# Altium project BLDC_v3.PrjPcb
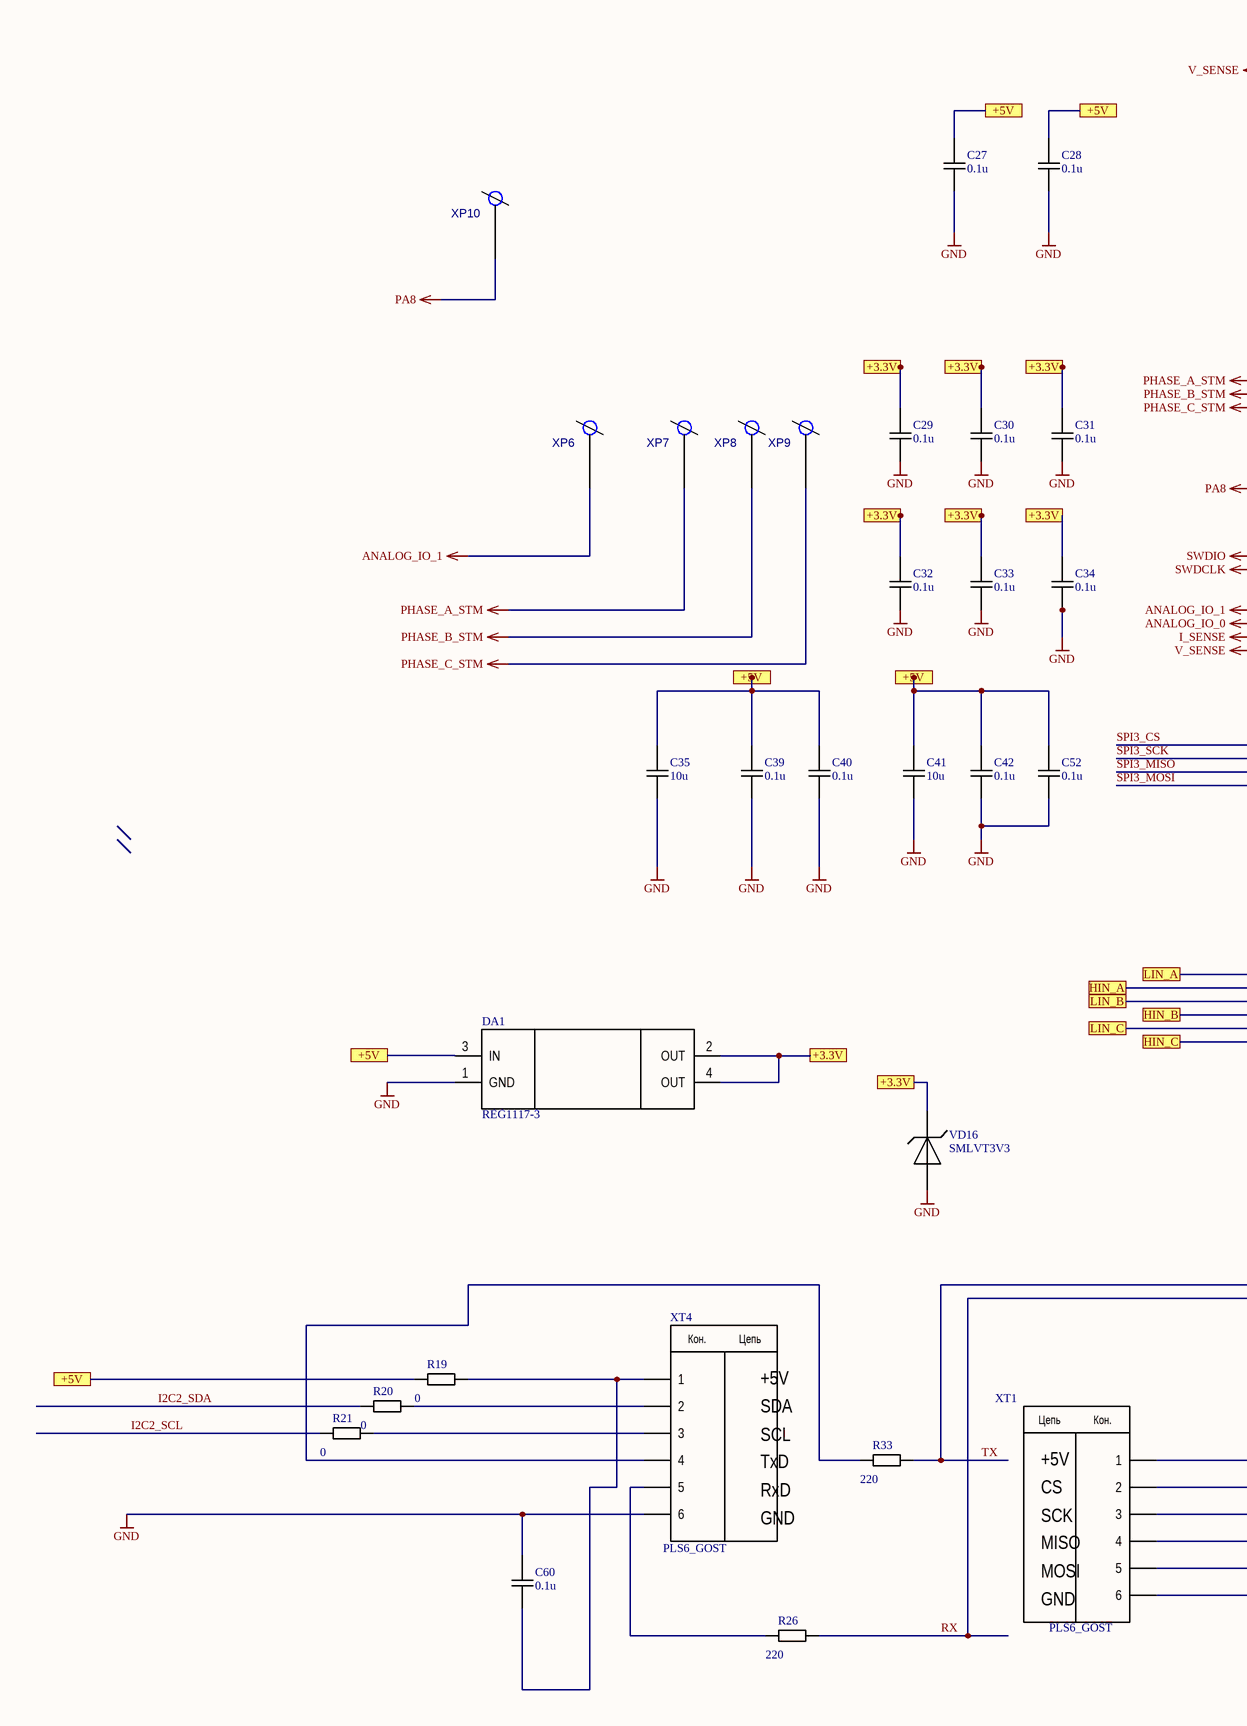
[diagram p0: BLDC_v3.SCHDOC, left]
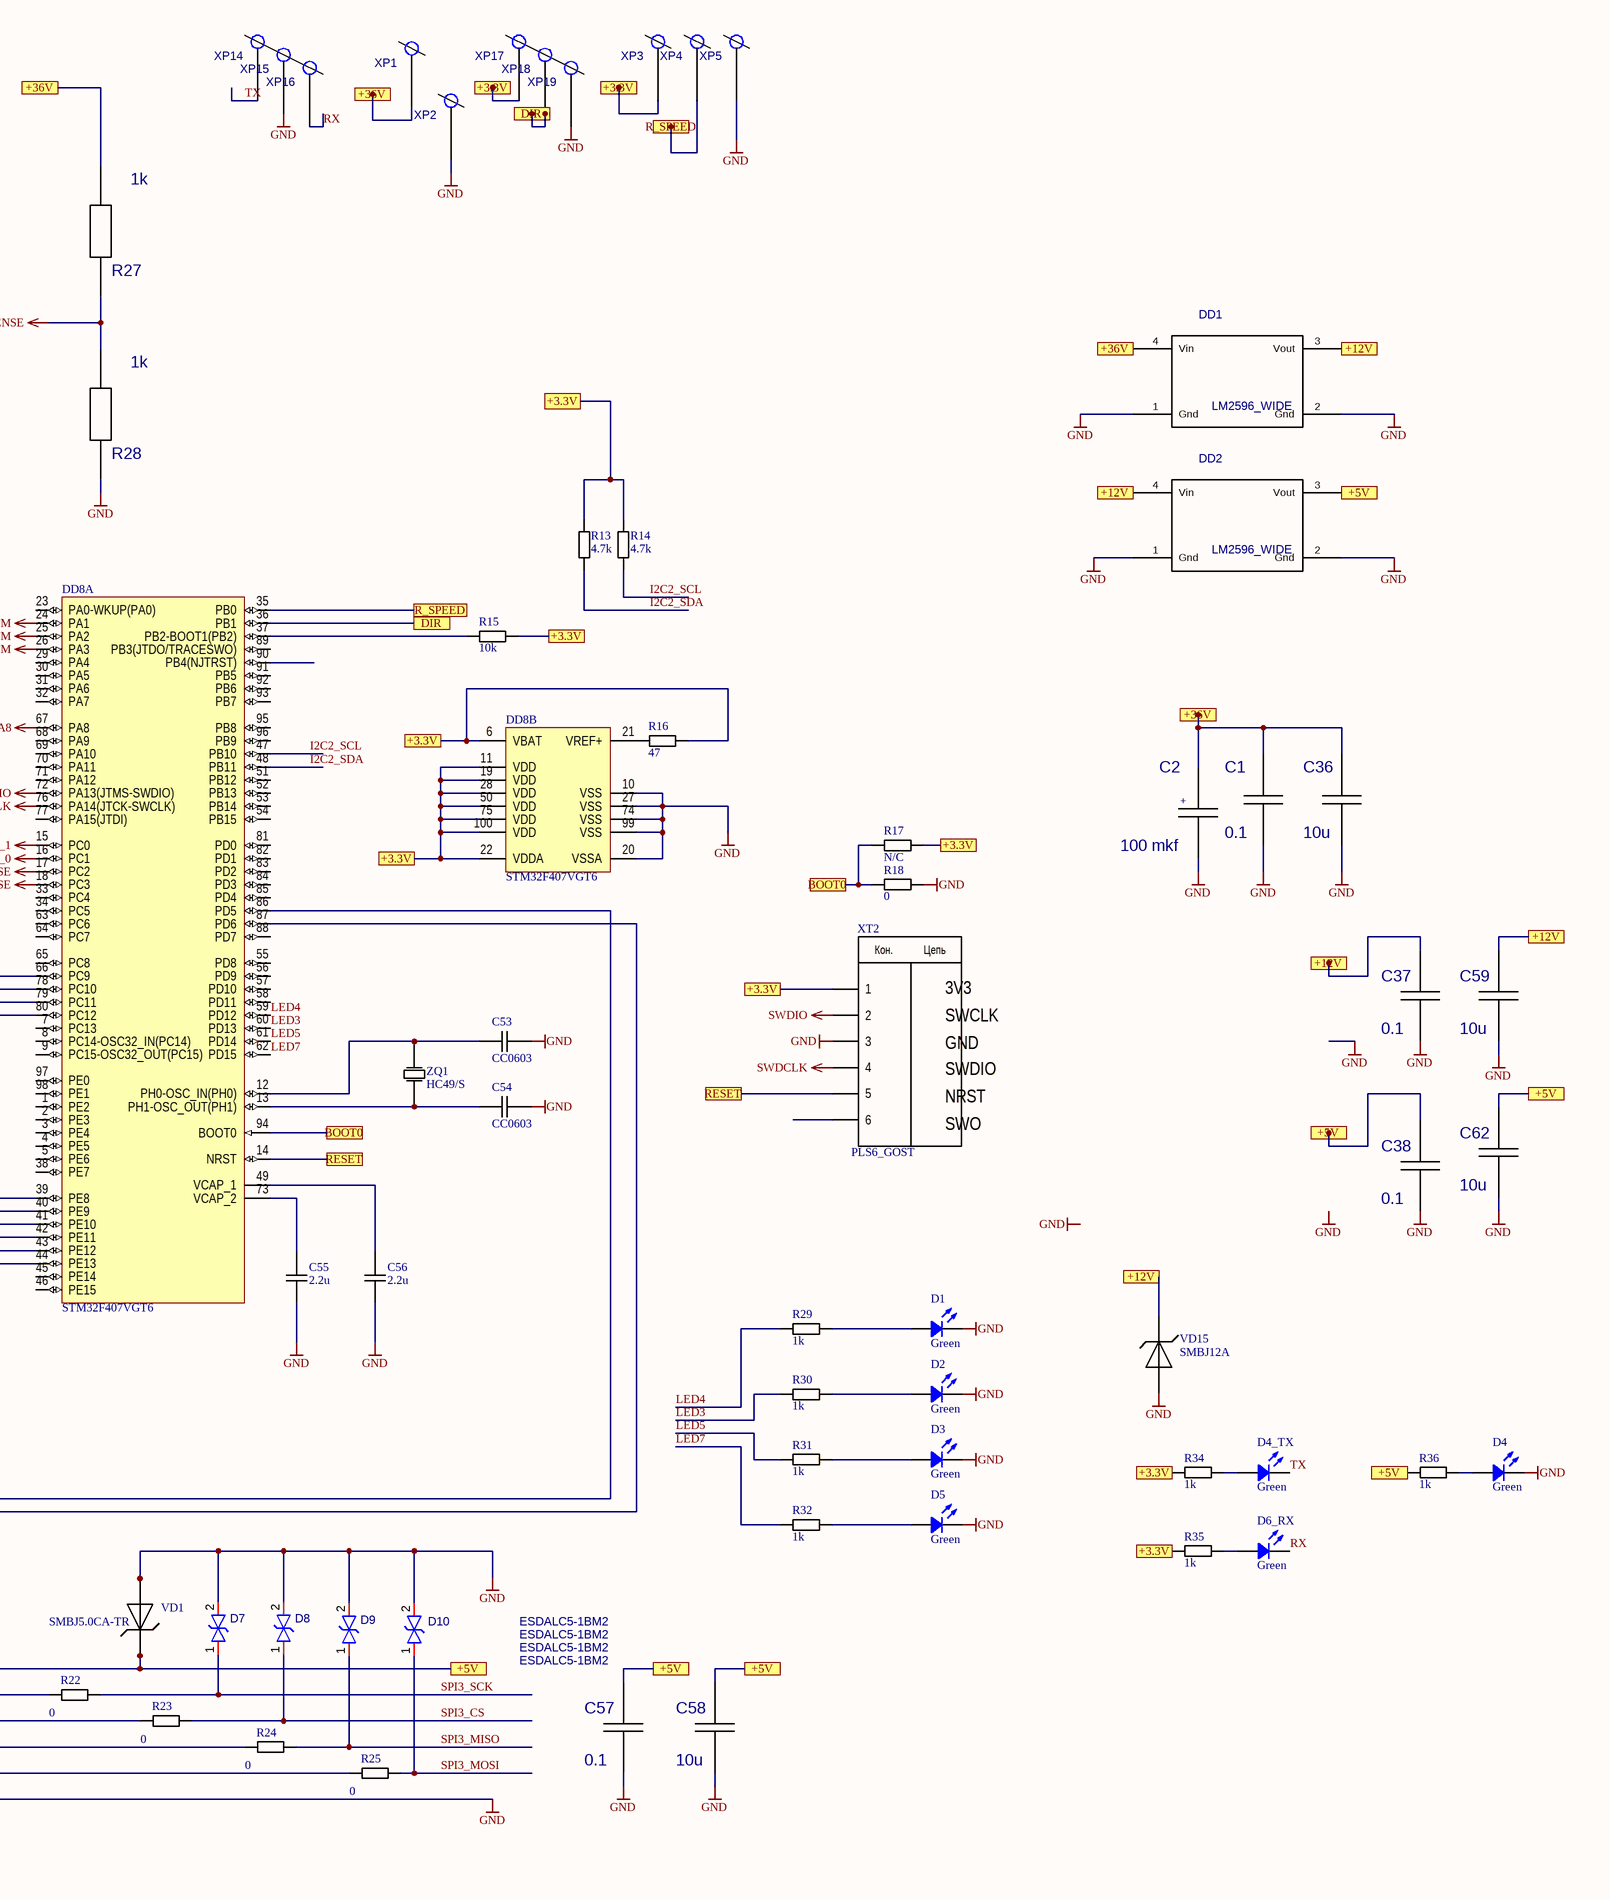
[diagram p1: BLDC_v3.SCHDOC, right]
1 sheet, 90 parts. Net scope: global (net labels, ports and power ports of the same name join across sheets).
Board file: BLDC_v3.PcbDoc

## Sheet BLDC_v3.SCHDOC
size 594 x 420 mm; CompanyName: МГТУ СМ-7; SheetNumber: 1; SheetTotal: 2; Scale: 1:1; Title2str: Драйвер BLDC; DocumentType: Схема электрическая принципиальная

### Parts
C1  value 0.1  [RC1206]  (hidden comment: C_1206)
C2  value 100 mkf  [C100_WIDE]  (hidden comment: C100_V_WIDE)
C27  0.1u  [SMT0603CAP/VISHAY]
C28  0.1u  [SMT0603CAP/VISHAY]
C29  0.1u  [SMT0603CAP/VISHAY]
C30  0.1u  [SMT0603CAP/VISHAY]
C31  0.1u  [SMT0603CAP/VISHAY]
C32  0.1u  [SMT0603CAP/VISHAY]
C33  0.1u  [SMT0603CAP/VISHAY]
C34  0.1u  [SMT0603CAP/VISHAY]
C35  10u  [SMT0603CAP/VISHAY]
C36  value 10u  [RC1206]  (hidden comment: C_1206)
C37  value 0.1  [RC1206]  (hidden comment: C_1206)
C38  value 0.1  [RC1206]  (hidden comment: C_1206)
C39  0.1u  [SMT0603CAP/VISHAY]
C40  0.1u  [SMT0603CAP/VISHAY]
C41  10u  [SMT0603CAP/VISHAY]
C42  0.1u  [SMT0603CAP/VISHAY]
C52  0.1u  [SMT0603CAP/VISHAY]
C53  CC0603  [SMT0603CAP/VISHAY]
C54  CC0603  [SMT0603CAP/VISHAY]
C55  2.2u  [SMT0603CAP/VISHAY]
C56  2.2u  [SMT0603CAP/VISHAY]
C57  value 0.1  [RC1206]  (hidden comment: C_1206)
C58  value 10u  [RC1206]  (hidden comment: C_1206)
C59  value 10u  [RC1206]  (hidden comment: C_1206)
C60  0.1u  [SMT0603CAP/VISHAY]
C62  value 10u  [RC1206]  (hidden comment: C_1206)
D1  Green  [LED 0805/2012 BLUE]
D2  Green  [LED 0805/2012 BLUE]
D3  Green  [LED 0805/2012 BLUE]
D4  Green  [LED 0805/2012 BLUE]
D4_TX  Green  [LED 0805/2012 BLUE]
D5  Green  [LED 0805/2012 BLUE]
D6_RX  Green  [LED 0805/2012 BLUE]
D7  ESDALC5-1BM2  [STM-SOD-882_BD_V]
D8  ESDALC5-1BM2  [STM-SOD-882_BD_V]
D9  ESDALC5-1BM2  [STM-SOD-882_BD_V]
D10  ESDALC5-1BM2  [STM-SOD-882_BD_V]
DA1  REG1117-3  [ZZ311]
DD1  LM2596_WIDE  [LM2596_WIDE]
DD2  LM2596_WIDE  [LM2596_WIDE]
DD8  STM32F407VGT6  [STM-LQFP100_N]  (parts A,B of 2)
R13  4.7k  [SMT0603/VISHAY]
R14  4.7k  [SMT0603/VISHAY]
R15  10k  [SMT0603/VISHAY]
R16  47  [SMT0603/VISHAY]
R17  N/C  [SMT0603/VISHAY]
R18  0  [SMT0603/VISHAY]
R19  0  [SMT0603/VISHAY]
R20  0  [SMT0603/VISHAY]
R21  0  [SMT0603/VISHAY]
R22  0  [SMT0603/VISHAY]
R23  0  [SMT0603/VISHAY]
R24  0  [SMT0603/VISHAY]
R25  0  [SMT0603/VISHAY]
R26  220  [SMT0603/VISHAY]
R27  value 1k  [CC1206]  (hidden comment: R_1206)
R28  value 1k  [CC1206]  (hidden comment: R_1206)
R29  1k  [SMT0603/VISHAY]
R30  1k  [SMT0603/VISHAY]
R31  1k  [SMT0603/VISHAY]
R32  1k  [SMT0603/VISHAY]
R33  220  [SMT0603/VISHAY]
R34  1k  [SMT0603/VISHAY]
R35  1k  [SMT0603/VISHAY]
R36  1k  [SMT0603/VISHAY]
VD1  SMBJ5.0CA-TR  [DO214AA SMB]
VD15  SMBJ12A  [DO214AA SMB]
VD16  SMLVT3V3  [DO214AA SMB]
XP1  XP_1_WIDE  [XP_WIDE]  (value not drawn)
XP2  XP_1_WIDE  [XP_WIDE]  (value not drawn)
XP3  XP_1_WIDE  [XP_WIDE]  (value not drawn)
XP4  XP_1_WIDE  [XP_WIDE]  (value not drawn)
XP5  XP_1_WIDE  [XP_WIDE]  (value not drawn)
XP6  XP_1_WIDE  [XP_WIDE]  (value not drawn)
XP7  XP_1_WIDE  [XP_WIDE]  (value not drawn)
XP8  XP_1_WIDE  [XP_WIDE]  (value not drawn)
XP9  XP_1_WIDE  [XP_WIDE]  (value not drawn)
XP10  XP_1_WIDE  [XP_WIDE]  (value not drawn)
XP14  XP_1_WIDE  [XP_WIDE]  (value not drawn)
XP15  XP_1_WIDE  [XP_WIDE]  (value not drawn)
XP16  XP_1_WIDE  [XP_WIDE]  (value not drawn)
XP17  XP_1_WIDE  [XP_WIDE]  (value not drawn)
XP18  XP_1_WIDE  [XP_WIDE]  (value not drawn)
XP19  XP_1_WIDE  [XP_WIDE]  (value not drawn)
XT1  PLS6_GOST  [XP_6_PIN]
XT2  PLS6_GOST  [XP_6_PIN]
XT4  PLS6_GOST  [XP_6_PIN]
ZQ1  HC49/S  [HS49/S]

### Ports
+3.3V, +5V, +12V, +36V, BOOT0, DIR, HIN_A, HIN_B, HIN_C, LIN_A, LIN_B, LIN_C, R_SPEED, RESET

### Nets
ANALOG_IO_0: DD8.16(PC1)
ANALOG_IO_1: DD8.15(PC0) XP6.1
GND: C1.1(A1) C2.2(A1) C27.1 C28.1 C29.1 C30.1 C31.1 C32.1 C33.1 C34.1 C35.1 C36.1(A1) C37.1(A1) C38.1(A1) C39.1 C40.1 C41.1 C42.1 C52.1 C53.2 C54.2 C55.1 C56.1 C57.1(A1) C58.1(A1) C59.1(A1) C60.2 C62.1(A1) D1.2 D2.2 D3.2 D4.2 D5.2 D7.2(A) D8.2(A) D9.2(A) D10.2(A) DA1.1(GND) DD1.1(Gnd) DD1.2(Gnd) DD2.1(Gnd) DD2.2(Gnd) DD8.10(VSS) DD8.20(VSSA) DD8.27(VSS) DD8.74(VSS) DD8.99(VSS) R18.1 R28.1(A1) VD1.1 VD15.1 VD16.1 XP2.1 XP5.1 XP15.1 XP19.1 XT1.6 XT2.3 XT4.6
I_SENSE: DD8.17(PC2)
PA8: DD8.67(PA8) XP10.1
PHASE_A_STM: DD8.24(PA1) XP7.1
PHASE_B_STM: DD8.25(PA2) XP8.1
PHASE_C_STM: DD8.26(PA3) XP9.1
SWDCLK: DD8.76(PA14(JTCK-SWCLK)) XT2.4
SWDIO: DD8.72(PA13(JTMS-SWDIO)) XT2.2
V_SENSE: DD8.18(PC3) R27.1(A1) R28.2(A2)
+3.3V: C29.2 C30.2 C31.2 C32.2 C33.2 C34.2 DA1.2(OUT) DA1.4(OUT) DD8.6(VBAT) DD8.11(VDD) DD8.19(VDD) DD8.22(VDDA) DD8.28(VDD) DD8.50(VDD) DD8.75(VDD) DD8.100(VDD) R13.2 R14.2 R15.1 R16.1 R17.1 R34.2 R35.2 VD16.2 XT2.1 ; port +3.3V
+5V: C27.2 C28.2 C57.2(A2) C58.2(A2) C62.2(A2) DA1.3(IN) DD2.3(Vout) R19.1 R36.2 VD1.2 XT1.1 ; port +5V
+12V: C59.2(A2) DD1.3(Vout) DD2.4(Vin) VD15.2 ; port +12V
+36V: DD1.4(Vin) R27.2(A2) ; port +36V
BOOT0: DD8.94(BOOT0) R17.2 R18.2 ; port BOOT0
DIR: DD8.36(PB1) ; port DIR
HIN_A: DD8.40(PE9) ; port HIN_A
HIN_B: DD8.42(PE11) ; port HIN_B
HIN_C: DD8.44(PE13) ; port HIN_C
I2C2_SCL: DD8.47(PB10) R14.1 R21.1
I2C2_SDA: DD8.48(PB11) R13.1 R20.1
LED3: DD8.60(PD13) R30.2
LED4: DD8.59(PD12) R29.2
LED5: DD8.61(PD14) R31.2
LED7: DD8.62(PD15) R32.2
LIN_A: DD8.39(PE8) ; port LIN_A
LIN_B: DD8.41(PE10) ; port LIN_B
LIN_C: DD8.43(PE12) ; port LIN_C
R_SPEED: DD8.35(PB0) ; port R_SPEED
RESET: DD8.14(NRST) XT2.5 ; port RESET
RX: D6_RX.2 DD8.87(PD6) R26.2 XP16.1
SPI3_CS: D8.1(A) DD8.66(PC9) R23.2
SPI3_MISO: D9.1(A) DD8.79(PC11) R24.2
SPI3_MOSI: D10.1(A) DD8.80(PC12) R25.2
SPI3_SCK: D7.1(A) DD8.78(PC10) R22.2
TX: D4_TX.2 DD8.86(PD5) R33.2 XP14.1
NetC1_2: C1.2(A2) C2.1(A2) C36.2(A2)
NetC35_2: C35.2 C39.2 C40.2
NetC41_2: C41.2 C42.2 C52.2
NetC53_1: C53.1 DD8.12(PH0-OSC_IN(PH0)) ZQ1.2
NetC54_1: C54.1 DD8.13(PH1-OSC_OUT(PH1)) ZQ1.1
NetC55_2: C55.2 DD8.73(VCAP_2)
NetC56_2: C56.2 DD8.49(VCAP_1)
NetC60_1: C60.1 R19.2 XT4.1
NetD1_1: D1.1 R29.1
NetD2_1: D2.1 R30.1
NetD3_1: D3.1 R31.1
NetD4_1: D4.1 R36.1
NetD4_TX_1: D4_TX.1 R34.1
NetD5_1: D5.1 R32.1
NetD6_RX_1: D6_RX.1 R35.1
NetDD8_21: DD8.21(VREF+) R16.2
NetDD8_37: DD8.37(PB2-BOOT1(PB2)) R15.2
NetR20_2: R20.2 XT4.2
NetR21_2: R21.2 XT4.3
NetR22_1: R22.1 XT1.2
NetR23_1: R23.1 XT1.3
NetR24_1: R24.1 XT1.4
NetR25_1: R25.1 XT1.5
NetR26_1: R26.1 XT4.5
NetR33_1: R33.1 XT4.4

Not connected (* = marked no-connect by the designer): C37 2(A2); C38 2(A2); DD8 1(PE2) 2(PE3) 3(PE4) 4(PE5) 5(PE6) 7(PC13) 8(PC14-OSC32_IN(PC14)) 9(PC15-OSC32_OUT(PC15)) 23(PA0-WKUP(PA0)) 29(PA4) 30(PA5) 31(PA6) 32(PA7) 33(PC4) 34(PC5) 38(PE7) 45(PE14) 46(PE15) 51(PB12) 52(PB13) 53(PB14) 54(PB15) 55(PD8) 56(PD9) 57(PD10) 58(PD11) 63(PC6) 64(PC7) 65(PC8) 68(PA9) 69(PA10) 70(PA11) 71(PA12) 77(PA15(JTDI)) 81(PD0) 82(PD1) 83(PD2) 84(PD3) 85(PD4) 88(PD7) 89(PB3(JTDO/TRACESWO)) 90(PB4(NJTRST)) 91(PB5) 92(PB6) 93(PB7) 95(PB8) 96(PB9) 97(PE0) 98(PE1); XP1 1; XP3 1; XP4 1; XP17 1; XP18 1; XT2 6

### Notes on the sheet
- (near XT2) SWCLK
- 3V3
- GND
- (near XT2) SWDIO
- (near XT2) NRST
- SWO
- SDA
- +5V
- SCL
- TxD
- RxD
- CS
- SCK
- (near XT1) MISO
- (near XT1) MOSI
- Labels drawn without touching a wire or pin: GND
- Перв. примен.
- Справ. №
- Подп. и дата
- Инв. № дубл.
- Взам. инв. №
- Разраб.
- Изм.
- Лист
- № докум.
- Подп.
- Дата
- Лит.
- Масса
- Масштаб
- Пров.
- Т.контр.
- Листов
- Инв. № подл.
- Утв.
- Н.контр.
- 2.106-A2
- Копировал
- Формат А2
- (in symbol C100_V_WIDE) +
- (in symbol PLS6_GOST) Цепь; Кон.

### Library data of the parts
C27-C35 C39-C42 C52-C56 C60 = CC0603: 50V 0603 cap
D1-D4 D4_TX D5 D6_RX = LED: Chip LED; Value: Green
D7-D10 = CMP-02192-4: Single Line Low Capacitance Transil™, 5 V, -55 to 150 degC, 2-Pin SOD-882, RoHS, Tape and Reel; Manufacturer: ST; Leakage Current: 0.05uA; ESD Protection Voltage: ?30KV@ContactDisc; DELETED: Compliant; Product Depth (mm): 0.6mm; Suppressor Type: TVS; Direction Type: Bi-Directional; Product Height (mm): 0.45(Max)mm; Capacitance Value: 30pF; Rad Hardened: No; Packaging: TapeandReel; Pin Count: 2; Leakage Current (Max): 0.05uA; Configuration: Single; Operating Temperature Max Deg. C: 150C; Datasheet URL: https://www.st.com/resource/en/datasheet/esdalc5-1bm2.pdf; Package Reference: STM-SOD-882; Operating Temperature Min Deg. C: -55C; Mounting Style: SurfaceMount
DA1 = REG1117-3: 800mA and 1A Low Dropout Positive Regulator 2.85V, 3.3V, 5V, and Adjustable; Published: 8-Jun-2000; LatestRevisionDate: 17-Jul-2002; LatestRevisionNote: Re-released for DXP Platform.; DatasheetVersion: Sep-1997; PackageVersion: revC; PackageReference: ZZ311; Publisher: Altium Limited; PackageDescription: SOT-223/SC-73; 4 Leads; Body 6.7 x 7.3 mm, inc. leads (LxW max); ComponentLink1Description: Manufacturer Link; ComponentLink1URL: http://www.ti.com/; ComponentLink2Description: Datasheet; ComponentLink2URL: http://www-s.ti.com/sc/ds/REG1117.pdf
DD8 = STM32F407VGT6: ARM Cortex-M4 32-bit MCU+FPU, 210 DMIPS, 1024 kB Flash, 192 kB Internal RAM, 82 I/Os, 100-pin LQFP, -40 to 85 degC, Tray; Manufacturer: STMicroelectronics; D/A Converter: 2x12-bit; FLASH Size (Prog) (kB): 1024; I/Os (High Current): 82; Internal RAM Size (kB): 192; Operating Frequency(F) (Processor speed) (MHz): 168; Supply Voltage(Vcc) max (V): 3.6; Supply Voltage(Vcc) min (V): 1.8; DatasheetVersion: Rev. 4; PackageVersion: Rev. 1, 06/2013; PackageReference: LQFP100; PackageDescription: 100-Pin Low Profile Quad Flat Package, 14 x 14 mm Body, 0.5 mm Pitch; Supplier 1: Digi-Key; Supplier Part Number 1: 497-11605-ND; Supplier 2: Farnell; Supplier Part Number 2: 2064368; Supplier 3: Newark; Supplier Part Number 3: 73T2333; Supplier 4: Mouser; Supplier Part Number 4: 511-STM32F407VGT6; Core: ARM Cortex-M4; Packing: Tray; Mounting Technology: Surface Mount; PartNumber: STM32F407VGT6; ComponentLink1Description: Manufacturer URL; ComponentLink1URL: http://www.st.com/web/en/home.html; ComponentLink2Description: Datasheet; ComponentLink2URL: http://www.st.com/st-web-ui/static/active/en/resource/technical/document/datasheet/DM00037051.pdf; ComponentLink3Description: Package Specification; ComponentLink3URL: http://www.st.com/st-web-ui/static/active/en/resource/technical/document/data_brief/DM00071938.pdf
R13 R14 R16-R26 R29-R36 = CRCW060310K0FKEA/MURATA: 10k
R15 = CRCW060310K0FKEA/MURATA
XT1 XT2 XT4 = PLS6_GOST: Header, 6-Pin; LatestRevisionDate: 17-Jul-2002; LatestRevisionNote: Re-released for DXP Platform.; Publisher: Altium Limited
ZQ1 = HC49/S: Crystal Oscillator
DD1 DD2 = LM2596_WIDE: Value: *
XP1-XP10 XP14-XP19 = XP_1_WIDE: Value: *